# EasyEDA Pro project P1.eprj, schematic Schematic2
Board Name: Board1; Create Date: 2025-03-10; Page Name: P1; Project Name: P1; Schematic Name: Schematic2; Update Date: 2025-03-10; Company: 嘉立创EDA; Page Size: A4; Version: V1.0
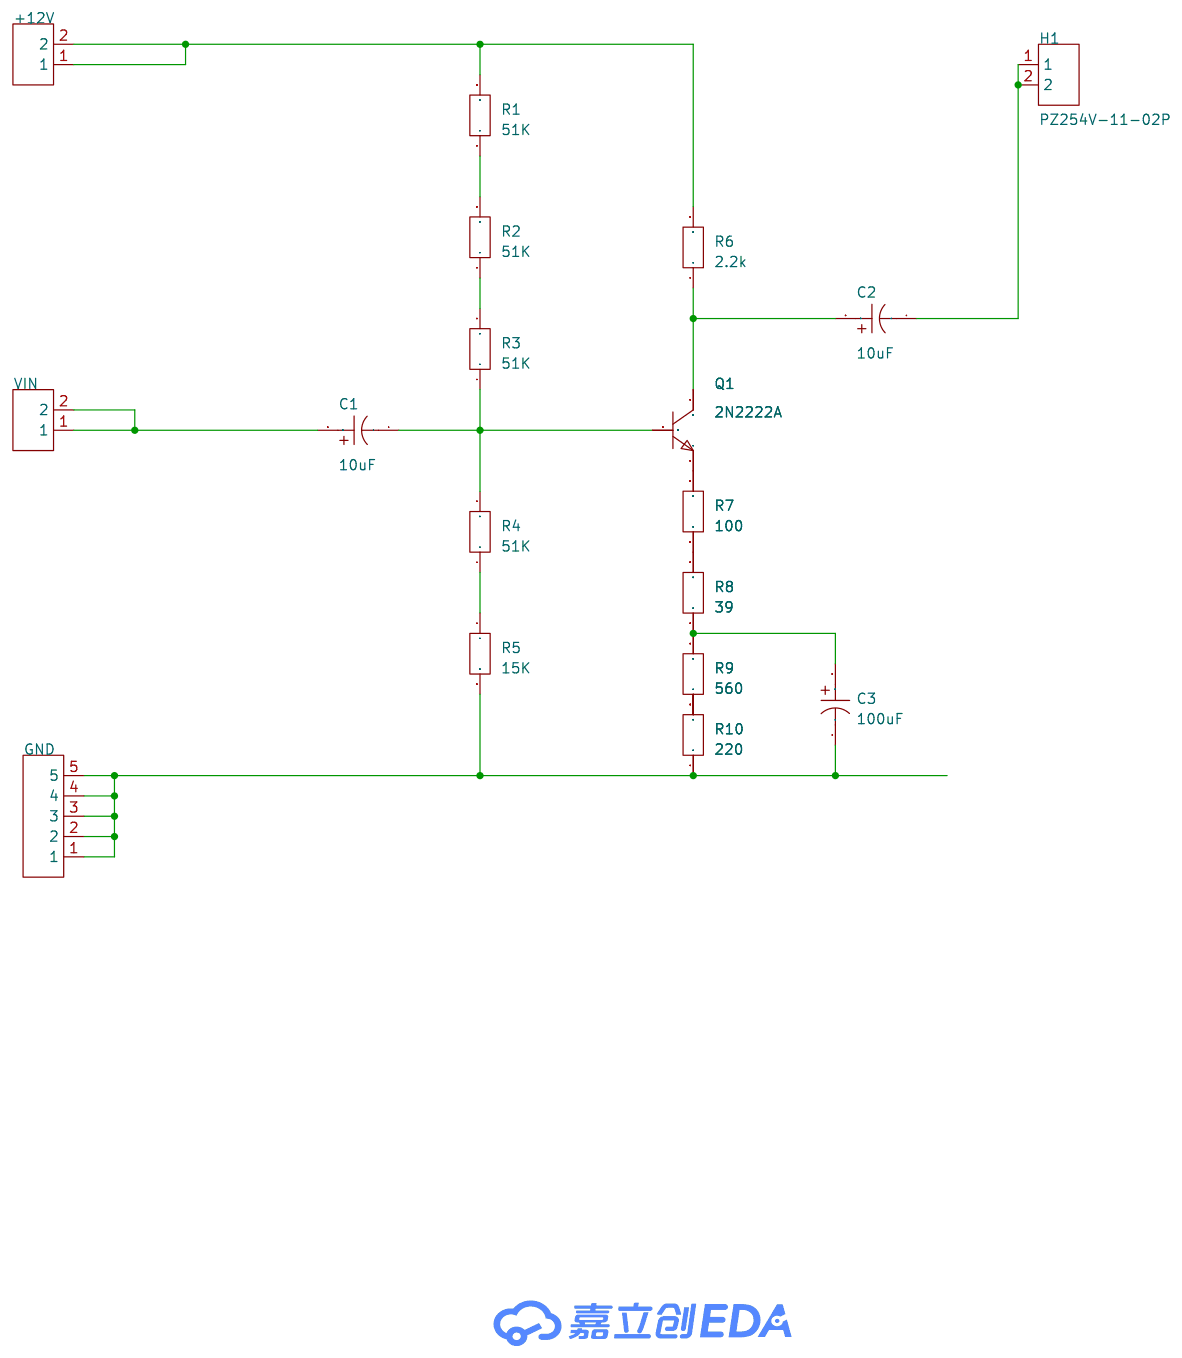
[diagram p3: schematic sheet]

## Parts
+12V  PZ254V-11-02P  [HDR-TH_2P-P2.54-V-M]
C1  10uF  [CAP-TH_BD5.5-P2.54-D0.5-FD]
C2  10uF  [CAP-TH_BD5.5-P2.54-D0.5-FD]
C3  100uF  [CAP-TH_BD5.5-P2.54-D0.5-FD]
GND  PZ254V-11-05P  [HDR-TH_5P-P2.54-V-M]
H1  PZ254V-11-02P  [HDR-TH_2P-P2.54-V-M]
Q1  2N2222A  [TO-92-3_L4.8-W3.7-P2.54-R]
R1  51K  [RES-TH_BD2.7-L6.2-P10.20-D0.4]
R2  51K  [RES-TH_BD2.7-L6.2-P10.20-D0.4]
R3  51K  [RES-TH_BD2.7-L6.2-P10.20-D0.4]
R4  51K  [RES-TH_BD2.7-L6.2-P10.20-D0.4]
R5  15K  [RES-TH_BD2.7-L6.2-P10.20-D0.4]
R6  2.2k  [RES-TH_BD2.7-L6.2-P10.20-D0.4]
R7  100  [RES-TH_BD2.7-L6.2-P10.20-D0.4]
R8  39  [RES-TH_BD2.7-L6.2-P10.20-D0.4]
R9  560  [RES-TH_BD2.7-L6.2-P10.20-D0.4]
R10  220  [RES-TH_BD2.7-L6.2-P10.20-D0.4]
VIN  PZ254V-11-02P  [HDR-TH_2P-P2.54-V-M]

## Library data of the parts
+12V H1 VIN = PZ254V-11-02P: LCSC Part Name: 1x2P 间距:2.54mm 方针 直插; Supplier Part: C492401; Manufacturer: XFCN(兴飞); Supplier Footprint: 插件,P=2.54mm; JLCPCB Part Class: 扩展库; Datasheet: https://atta.szlcsc.com/upload/public/pdf/source/20200309/C492401_A812433581A9B211A7FFA413ADDFF0E5.pdf; Supplier: LCSC; Pin Structure: 1x2P; Pitch: 2.54mm; Circluar Pins/Square Pins: 方针; Mounting Type: 直插; Number of Rows: 单排; Number of Pins: 2P; Length of Mating Pin: 6mm; Insulation Height: 2.5mm; Length of End Connection Pin: 3mm; Contact Material: 黄铜; Operating Temperature: -40℃~+105℃; Color: 黑色
C1-C3 = 199D106X0025C1V1E3: LCSC Part Name: 10uF ±20% 25V; Supplier Part: C1651807; Manufacturer: VISHAY(威世); Supplier Footprint: 插件; JLCPCB Part Class: 扩展库; Datasheet: https://atta.szlcsc.com/upload/public/pdf/source/20210702/CD5661637E1895F7F44D1BD24DD66A39.pdf; Supplier: LCSC; Tolerance: ±20%; Rated Voltage: 25V; Operating Temperature: -55℃~+125℃
GND = PZ254V-11-05P: LCSC Part Name: 1x5P 间距:2.54mm 方针 直插; Supplier Part: C492404; Manufacturer: XFCN(兴飞); Supplier Footprint: 插件,P=2.54mm; JLCPCB Part Class: 扩展库; Datasheet: https://atta.szlcsc.com/upload/public/pdf/source/20200309/C492404_E51533260F8710EFF5D4617281164C1D.pdf; Supplier: LCSC; Pin Structure: 1x5P; Pitch: 2.54mm; Circluar Pins/Square Pins: 方针; Mounting Type: 直插; Number of Rows: 单排; Number of Pins: 5P; Length of Mating Pin: 6mm; Insulation Height: 2.5mm; Length of End Connection Pin: 3mm; Contact Material: 黄铜; Operating Temperature: -40℃~+105℃; Color: 黑色
Q1 = 2N2222A_C358533: LCSC Part Name: NPN 电流:600mA 耐压:40V (100-300); Supplier Part: C358533; Manufacturer: BLUE ROCKET(蓝箭); Supplier Footprint: TO-92-3; JLCPCB Part Class: 扩展库; Datasheet: https://atta.szlcsc.com/upload/public/pdf/source/20190129/C358533_AFAFE39542E316DF9E781A186BBE98F7.pdf; Supplier: LCSC; Transistor Type: NPN; Collector Current (Ic): 600mA; Collector-Emitter Breakdown Voltage (Vceo): 40V; Power Dissipation (Pd): 625mW; DC Current Gain (hFE@Ic,Vce): 100@150mA,10V; Transition Frequency (fT): 300MHz; Collector Cut-Off Current (Icbo): 100nA; Collector-Emitter Saturation Voltage (VCE(sat)@Ic,Ib): 600mV@500mA,50mA
R1-R10 = MF1/4W-1K±1%-ST52: LCSC Part Name: 金属膜电阻 1kΩ ±1% 250mW; Supplier Part: C2903245; Manufacturer: VO(翔胜); Supplier Footprint: 插件,D2.7xL6.2mm; JLCPCB Part Class: 扩展库; Datasheet: https://atta.szlcsc.com/upload/public/pdf/source/20200609/C601728_5AA4C0C8E12E11069DA2C3356F29D1F2.pdf; Supplier: LCSC; Type: 金属膜电阻; Tolerance: ±1%; Overload Voltage (Max): 250V; Power(Watts): 250mW; Temperature Coefficient: ±100ppm/℃; Operating Temperature Range: -55℃~+155℃

## Nets
Net-(+12V-1): +12V.1 +12V.2 R1.2 R6.2
Net-(C1-1): C1.1 Q1.2(B) R3.1 R4.2
Net-(C1-2): C1.2 VIN.1 VIN.2
Net-(C2-1): C2.1 H1.1 H1.2
Net-(C2-2): C2.2 Q1.1(C) R6.1
Net-(C3-1): C3.1 GND.1 GND.2 GND.3 GND.4 GND.5 R5.2 R10.1
Net-(C3-2): C3.2 R8.1 R9.2
Net-(Q1-3): Q1.3(E) R7.2
Net-(R1-1): R1.1 R2.2
Net-(R2-1): R2.1 R3.2
Net-(R4-1): R4.1 R5.1
Net-(R7-1): R7.1 R8.2
Net-(R9-1): R9.1 R10.2
